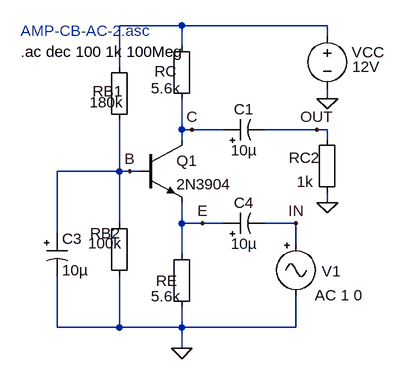
[diagram p0: schematic AMP-CB-AC-2.asc]
AMP-CB-AC-2.asc, the LTspice schematic file:
Version 4
SHEET 1 880 680
WIRE 192 -96 96 -96
WIRE 416 -96 192 -96
WIRE 416 -80 416 -96
WIRE 192 -64 192 -96
WIRE 96 -32 96 -96
WIRE 416 16 416 0
WIRE 192 64 192 16
WIRE 208 64 192 64
WIRE 256 64 208 64
WIRE 400 64 320 64
WIRE 416 64 400 64
WIRE 192 80 192 64
WIRE 416 80 416 64
WIRE 96 128 96 48
WIRE 96 128 0 128
WIRE 112 128 96 128
WIRE 128 128 112 128
WIRE 416 176 416 160
WIRE 96 208 96 128
WIRE 192 208 192 176
WIRE 224 208 192 208
WIRE 256 208 224 208
WIRE 368 208 320 208
WIRE 0 224 0 128
WIRE 368 240 368 208
WIRE 192 256 192 208
WIRE 0 368 0 288
WIRE 96 368 96 288
WIRE 96 368 0 368
WIRE 192 368 192 336
WIRE 192 368 96 368
WIRE 368 368 368 320
WIRE 368 368 192 368
WIRE 192 400 192 368
FLAG 416 16 0
FLAG 368 208 IN
FLAG 192 400 0
FLAG 208 64 C
FLAG 112 128 B
FLAG 224 208 E
FLAG 400 64 OUT
FLAG 416 176 0
SYMBOL npn 128 80 R0
SYMATTR InstName Q1
SYMATTR Value 2N3904
SYMBOL Misc\\EuropeanResistor 80 -48 R0
WINDOW 0 -25 53 Left 2
WINDOW 3 -30 70 Left 2
SYMATTR InstName RB1
SYMATTR Value 180k
SYMBOL Misc\\EuropeanResistor 176 -80 R0
WINDOW 0 -26 54 Left 2
WINDOW 3 -31 80 Left 2
SYMATTR InstName RC
SYMATTR Value 5.6k
SYMBOL Misc\\signal 368 224 R0
WINDOW 123 29 95 Left 2
WINDOW 0 40 58 Left 2
WINDOW 3 8 103 Left 2
WINDOW 39 0 0 Left 0
SYMATTR Value2 AC 1 0
SYMATTR InstName V1
SYMATTR Value ""
SYMBOL voltage 416 -96 R0
WINDOW 0 38 41 Left 2
WINDOW 3 39 63 Left 2
WINDOW 123 0 0 Left 2
WINDOW 39 0 0 Left 2
SYMATTR InstName VCC
SYMATTR Value 12V
SYMBOL polcap 256 224 R270
WINDOW 0 32 32 VTop 2
WINDOW 3 0 32 VBottom 2
SYMATTR InstName C4
SYMATTR Value 10µ
SYMATTR Description Capacitor
SYMATTR Type cap
SYMATTR SpiceLine V=12.5 Irms=2.12132 Rser=0.06 Lser=0
SYMBOL Misc\\EuropeanResistor 176 240 R0
WINDOW 0 -24 56 Left 2
WINDOW 3 -31 80 Left 2
SYMATTR InstName RE
SYMATTR Value 5.6k
SYMBOL Misc\\EuropeanResistor 80 192 R0
WINDOW 0 -29 31 Left 2
WINDOW 3 -32 47 Left 2
SYMATTR InstName RB2
SYMATTR Value 100k
SYMBOL polcap 256 80 R270
WINDOW 0 32 32 VTop 2
WINDOW 3 0 32 VBottom 2
SYMATTR InstName C1
SYMATTR Value 10µ
SYMATTR Description Capacitor
SYMATTR Type cap
SYMATTR SpiceLine V=35 Irms=65m Rser=0.9 Lser=3.04n mfg="Wьrth Elektronik" pn="860240572001 WCAP-AT1H 5x11" type="Al electrolytic"
SYMBOL Misc\\EuropeanResistor 400 64 R0
WINDOW 0 -43 43 Left 2
WINDOW 3 -31 80 Left 2
SYMATTR InstName RC2
SYMATTR Value 1k
SYMBOL polcap -16 224 R0
WINDOW 3 24 56 Left 2
SYMATTR Value 10µ
SYMATTR InstName C3
SYMATTR Description Capacitor
SYMATTR Type cap
SYMATTR SpiceLine V=10 Irms=48m Rser=0.8111 Lser=4.07n
TEXT -56 -56 Left 2 !.ac dec 100 1k 100Meg
TEXT -56 -88 Left 2 ;AMP-CB-AC-2.asc

The netlist it stands for:
* AMP-CB-AC-2.asc
Q1 C B E 0 2N3904
RB1 N001 B 180k
RC N001 C 5.6k
V1 IN 0 AC 1 0
VCC N001 0 12V
C4 E IN 10µ V=12.5 Irms=2.12132 Rser=0.06 Lser=0
RE E 0 5.6k
RB2 B 0 100k
C1 C OUT 10µ V=35 Irms=65m Rser=0.9 Lser=3.04n mfg="Wьrth Elektronik" pn="860240572001 WCAP-AT1H 5x11" type="Al electrolytic"
RC2 OUT 0 1k
C3 B 0 10µ V=10 Irms=48m Rser=0.8111 Lser=4.07n
.model NPN NPN
.model PNP PNP
.lib standard.bjt
.ac dec 100 1k 100Meg
* AMP-CB-AC-2.asc
.backanno
.end